# EAGLE schematic LED Driver R1.4 (10cm x 7cm) (EAGLE 6.2)

## Sheet 1 of 2
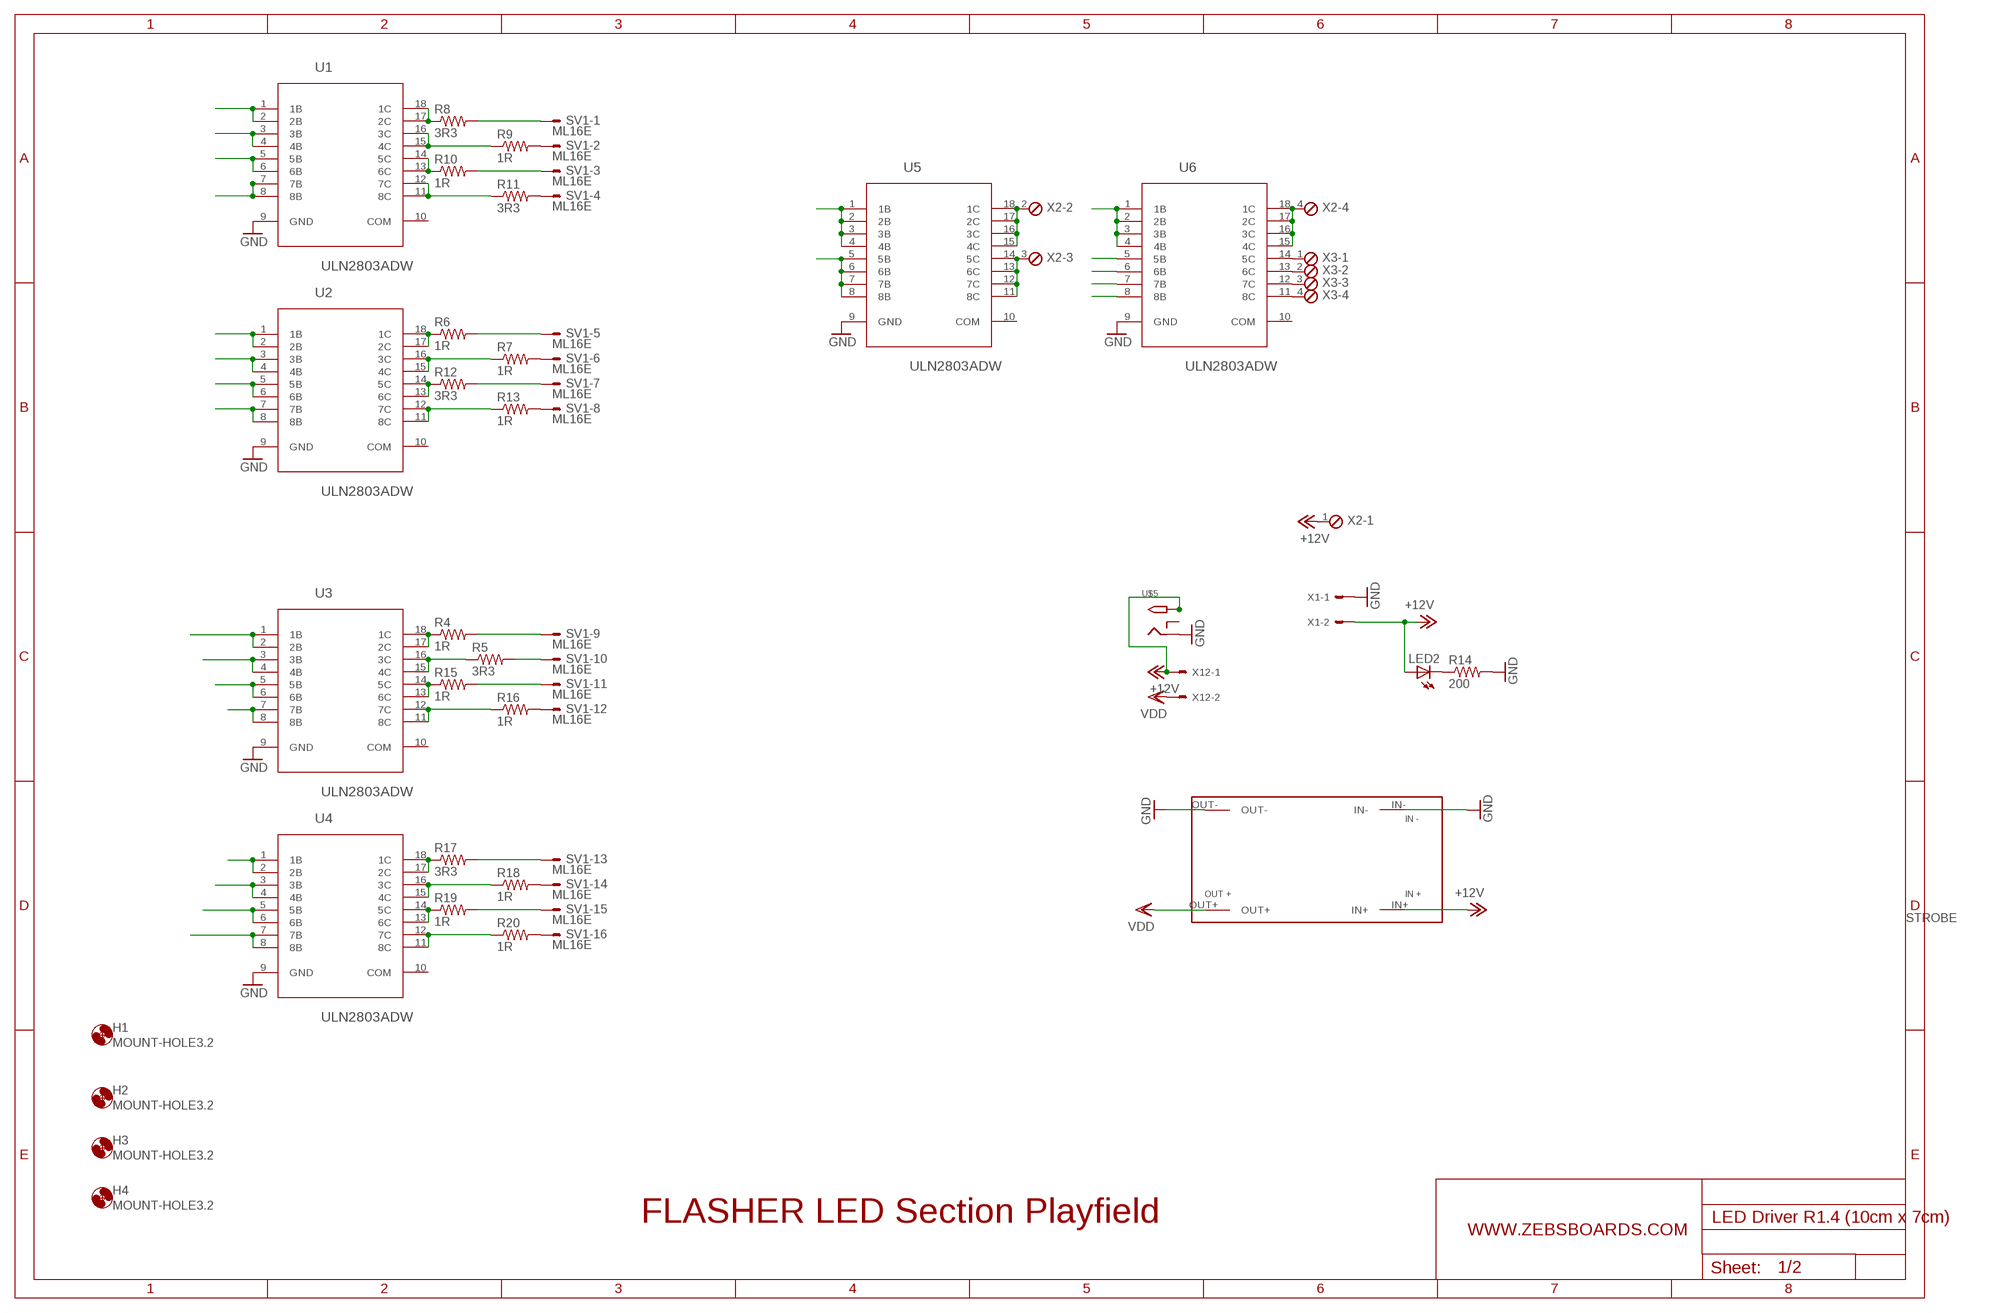
[diagram p0: schematic, sheet 1]

### Parts
H1  MOUNT-HOLE3.2  [3,2]
H2  MOUNT-HOLE3.2  [3,2]
H3  MOUNT-HOLE3.2  [3,2]
H4  MOUNT-HOLE3.2  [3,2]
LED2  LEDCHIP-LED0805  [CHIP-LED0805]
R4  1R  R-US_R2010W  [R2010W]
R5  3R3  R-US_R2010W  [R2010W]
R6  1R  R-US_R2010W  [R2010W]
R7  1R  R-US_R2010W  [R2010W]
R8  3R3  R-US_R2010W  [R2010W]
R9  1R  R-US_R2010W  [R2010W]
R10  1R  R-US_R2010W  [R2010W]
R11  3R3  R-US_R2010W  [R2010W]
R12  3R3  R-US_R2010W  [R2010W]
R13  1R  R-US_R2010W  [R2010W]
R14  200  R-US_M0805  [M0805]
R15  1R  R-US_R2010W  [R2010W]
R16  1R  R-US_R2010W  [R2010W]
R17  3R3  R-US_R2010W  [R2010W]
R18  1R  R-US_R2010W  [R2010W]
R19  1R  R-US_R2010W  [R2010W]
R20  1R  R-US_R2010W  [R2010W]
SV1  ML16E  [ML16]
U1  ULN2803ADW  [SOIC127P1030X265-18N]
U2  ULN2803ADW  [SOIC127P1030X265-18N]
U3  ULN2803ADW  [SOIC127P1030X265-18N]
U4  ULN2803ADW  [SOIC127P1030X265-18N]
U5  ULN2803ADW  [SOIC127P1030X265-18N]
U6  ULN2803ADW  [SOIC127P1030X265-18N]
U$1  DC1ACONVERTER  [DC1CONVERTER]
U$5  2.1MMJACKTHM  [PJ-102A]
X1  KK-156-2  [KK-156-2]
X2  MPT4  [4POL254]
X3  MPT4  [4POL254]
X12  KK-156-2  [KK-156-2]

### Nets
+12V: LED2.A U$1.IN+ U$5.TIP X1.2 X2.1 X12.1
D1: U1.1(1B) U1.2(2B) ; also sheet 2
D2: U1.3(3B) U1.4(4B) ; also sheet 2
D3: U1.5(5B) U1.6(6B) ; also sheet 2
D4: U1.7(7B) U1.8(8B) ; also sheet 2
D5: U2.1(1B) U2.2(2B) ; also sheet 2
D6: U2.3(3B) U2.4(4B) ; also sheet 2
D7: U2.5(5B) U2.6(6B) ; also sheet 2
D8: U2.7(7B) U2.8(8B) ; also sheet 2
D9: U3.1(1B) U3.2(2B) ; also sheet 2
D10: U3.3(3B) U3.4(4B) ; also sheet 2
D11: U3.5(5B) U3.6(6B) ; also sheet 2
D12: U3.7(7B) U3.8(8B) ; also sheet 2
D13: U4.1(1B) U4.2(2B) ; also sheet 2
D14: U4.3(3B) U4.4(4B) ; also sheet 2
D15: U4.5(5B) U4.6(6B) ; also sheet 2
D16: U4.7(7B) U4.8(8B) ; also sheet 2
D17: U5.1(1B) U5.2(2B) U5.3(3B) U5.4(4B) ; also sheet 2
D18: U5.5(5B) U5.6(6B) U5.7(7B) U5.8(8B) ; also sheet 2
D19: U6.1(1B) U6.2(2B) U6.3(3B) U6.4(4B) ; also sheet 2
D20: U6.5(5B) ; also sheet 2
D21: U6.6(6B) ; also sheet 2
D22: U6.7(7B) ; also sheet 2
D23: U6.8(8B) ; also sheet 2
GND: R14.2 U1.9(GND) U2.9(GND) U3.9(GND) U4.9(GND) U5.9(GND) U6.9(GND) U$1.IN- U$1.OUT- U$5.RING X1.1 ; also sheet 2
N$1: R9.1 U1.15(4C) U1.16(3C)
N$2: R8.2 SV1.1
N$3: R10.2 SV1.3
N$4: R11.1 U1.11(8C) U1.12(7C)
N$5: R4.1 U3.17(2C) U3.18(1C)
N$6: R5.2 SV1.10
N$7: R15.1 U3.13(6C) U3.14(5C)
N$8: R8.1 U1.17(2C) U1.18(1C)
N$9: R7.1 U2.15(4C) U2.16(3C)
N$10: R6.2 SV1.5
N$11: R12.2 SV1.7
N$12: R13.1 U2.11(8C) U2.12(7C)
N$13: R9.2 SV1.2
N$14: R10.1 U1.13(6C) U1.14(5C)
N$15: R11.2 SV1.4
N$16: R6.1 U2.17(2C) U2.18(1C)
N$17: R5.1 U3.15(4C) U3.16(3C)
N$18: R4.2 SV1.9
N$19: R15.2 SV1.11
N$20: R16.1 U3.11(8C) U3.12(7C)
N$21: R7.2 SV1.6
N$22: R12.1 U2.13(6C) U2.14(5C)
N$23: R13.2 SV1.8
N$24: R16.2 SV1.12
N$25: R18.1 U4.15(4C) U4.16(3C)
N$26: LED2.C R14.1
N$27: R17.2 SV1.13
N$28: R19.2 SV1.15
N$29: R20.1 U4.11(8C) U4.12(7C)
N$30: R17.1 U4.17(2C) U4.18(1C)
N$31: R18.2 SV1.14
N$32: R19.1 U4.13(6C) U4.14(5C)
N$33: R20.2 SV1.16
N$42: U5.15(4C) U5.16(3C) U5.17(2C) U5.18(1C) X2.2
N$43: U5.11(8C) U5.12(7C) U5.13(6C) U5.14(5C) X2.3
N$44: U6.15(4C) U6.16(3C) U6.17(2C) U6.18(1C) X2.4
N$45: U6.14(5C) X3.1
N$46: U6.13(6C) X3.2
N$47: U6.12(7C) X3.3
N$48: U6.11(8C) X3.4
VDD: U$1.OUT+ X12.2
Unconnected: U1.10(COM) U2.10(COM) U3.10(COM) U4.10(COM) U5.10(COM) U6.10(COM) U$5.RING_SW

### Notes on the sheet
- STROBE
- FLASHER LED Section Playfield
- WWW.ZEBSBOARDS.COM

## Sheet 2 of 2
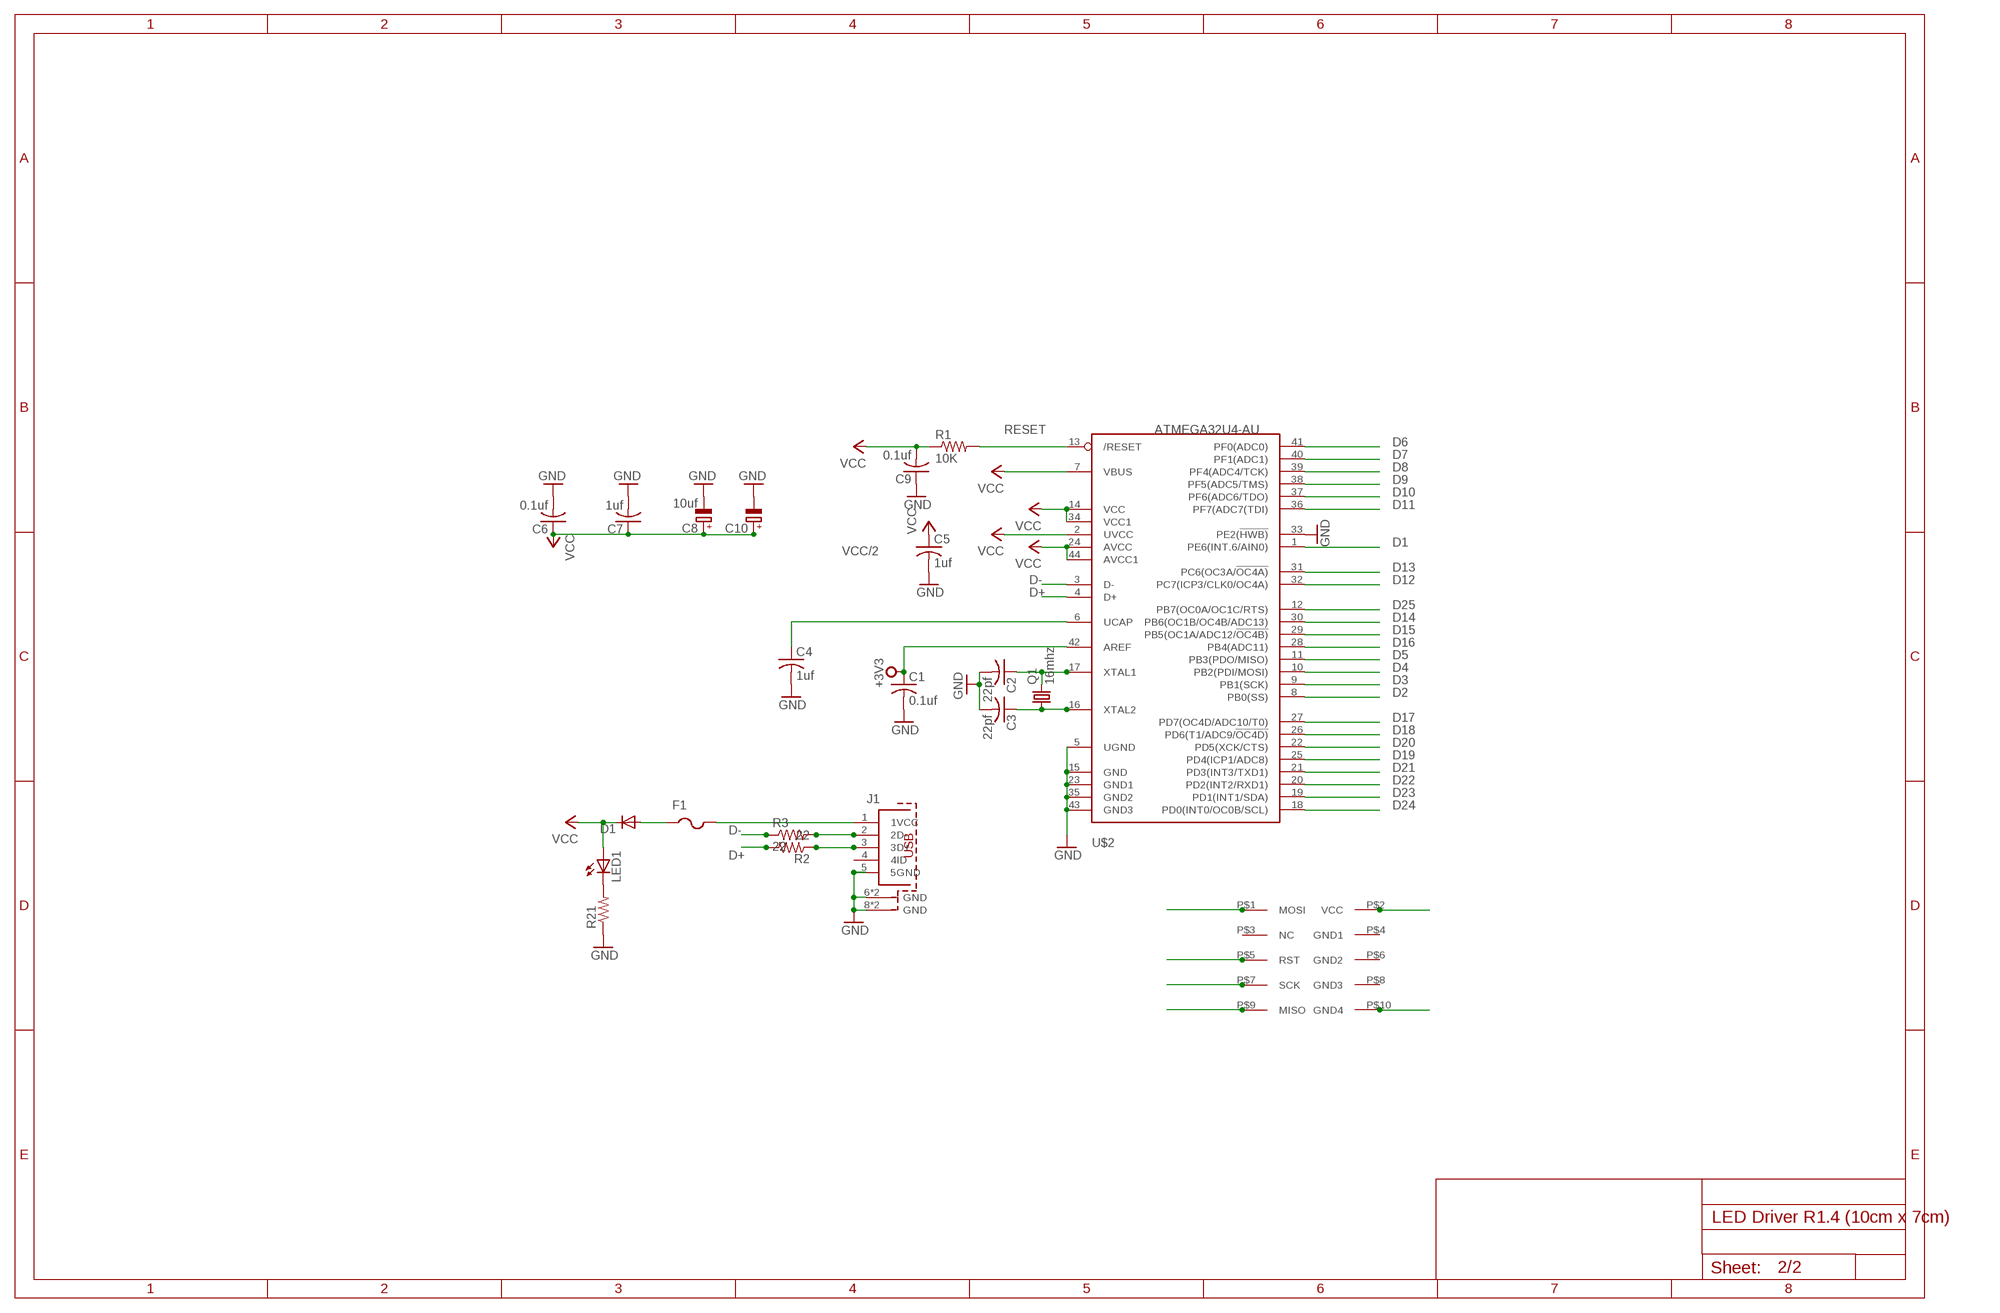
[diagram p1: schematic, sheet 2]

### Parts
C1  0.1uf  C-USC0603  [C0603]
C2  22pf  C-USC0603  [C0603]
C3  22pf  C-USC0603  [C0603]
C4  1uf  C-USC0603  [C0603]
C5  1uf  C-USC0603  [C0603]
C6  0.1uf  C-USC0603  [C0603]
C7  1uf  C-USC0603  [C0603]
C8  10uf  CPOL-EUA/3216-18W  [A/3216-18W]
C9  0.1uf  C-USC0603  [C0603]
C10  CPOL-EU153CLV-0605  [153CLV-0605]
D1  DIODE-DO214AC  [DO214AC]
F1  PTCFUSE-1812  [1812]
J1  651005136521  [651005136521]
LED1  LEDCHIPLED_0805  [CHIPLED_0805]
Q1  16mhz  CRYSTALCTS406  [CTS406]
R1  10K  R-US_M0805  [M0805]
R2  22  R-US_M0805  [M0805]
R3  22  R-US_M0805  [M0805]
R21  R-US_M0805  [M0805]
U$2  ATMEGA32U4-AU  [TQFP44]
U$4  10PICSP  [10PICSP]

### Nets
+3V3: C1.1 U$2.42(AREF)
D1: U$2.1(PE6(INT.6/AIN0)) ; also sheet 1
D2: U$2.8(PB0(SS)) ; also sheet 1
D3: U$2.9(PB1(SCK)) U$4.P$7(SCK) ; also sheet 1
D4: U$2.10(PB2(PDI/MOSI)) U$4.P$1(MOSI) ; also sheet 1
D5: U$2.11(PB3(PDO/MISO)) U$4.P$9(MISO) ; also sheet 1
D6: U$2.41(PF0(ADC0)) ; also sheet 1
D7: U$2.40(PF1(ADC1)) ; also sheet 1
D8: U$2.39(PF4(ADC4/TCK)) ; also sheet 1
D9: U$2.38(PF5(ADC5/TMS)) ; also sheet 1
D10: U$2.37(PF6(ADC6/TDO)) ; also sheet 1
D11: U$2.36(PF7(ADC7(TDI)) ; also sheet 1
D12: U$2.32(PC7(ICP3/CLK0/OC4A)) ; also sheet 1
D13: U$2.31(PC6(OC3A/!OC4A)) ; also sheet 1
D14: U$2.30(PB6(OC1B/OC4B/ADC13)) ; also sheet 1
D15: U$2.29(PB5(OC1A/ADC12/!OC4B)) ; also sheet 1
D16: U$2.28(PB4(ADC11)) ; also sheet 1
D17: U$2.27(PD7(OC4D/ADC10/T0)) ; also sheet 1
D18: U$2.26(PD6(T1/ADC9/!OC4D)) ; also sheet 1
D19: U$2.25(PD4(ICP1/ADC8)) ; also sheet 1
D20: U$2.22(PD5(XCK/CTS)) ; also sheet 1
D21: U$2.21(PD3(INT3/TXD1)) ; also sheet 1
D22: U$2.20(PD2(INT2/RXD1)) ; also sheet 1
D23: U$2.19(PD1(INT1/SDA)) ; also sheet 1
D24: U$2.18(PD0(INT0/OC0B/SCL))
D25: U$2.12(PB7(OC0A/OC1C/RTS))
D+: R2.2 U$2.4(D+)
D-: R3.1 U$2.3(D-)
GND: C1.2 C2.2 C3.2 C4.2 C5.2 C6.2 C7.2 C8.- C9.1 C10.- J1.5(5GND) J1.6(GND) J1.7(GND) J1.8(GND) J1.9(GND) R21.1 U$2.5(UGND) U$2.15(GND) U$2.23(GND1) U$2.33(PE2(!HWB)) U$2.35(GND2) U$2.43(GND3) U$4.P$10(GND4) ; also sheet 1
N$34: C2.1 Q1.3 U$2.17(XTAL1)
N$35: C3.1 Q1.1 U$2.16(XTAL2)
N$36: C4.1 U$2.6(UCAP)
N$37: J1.2(2D-) R3.2
N$38: J1.3(3D+) R2.1
N$39: F1.2 J1.1(1VCC)
N$40: D1.A F1.1
N$41: LED1.C R21.2
RST: R1.2 U$2.13(/RESET) U$4.P$5(RST)
VCC: C5.1 C6.1 C7.1 C8.+ C9.2 C10.+ D1.C LED1.A R1.1 U$2.2(UVCC) U$2.7(VBUS) U$2.14(VCC) U$2.24(AVCC) U$2.34(VCC1) U$2.44(AVCC1) U$4.P$2(VCC)
Unconnected: J1.4(4ID) U$4.P$3(NC) U$4.P$4(GND1) U$4.P$6(GND2) U$4.P$8(GND3)

### Notes on the sheet
- RESET
- D6
- D7
- D8
- D9
- D10
- D11
- VCC/2 | D1
- D13
- D- | D12
- D+
- D25
- D14
- D15
- D16
- D5
- D4
- D3
- D2
- D17
- D18
- D20
- D19
- D21
- D22
- D23
- D24
- D-
- D+

## Library data of the parts
C1-C3 C6 C9 = adafruit:C-US: CAPACITOR, American symbol
C4 C5 C7 = resistor:C-US: CAPACITOR, American symbol
C8 C10 = resistor:CPOL-EU: POLARIZED CAPACITOR, European symbol
D1 = diode:DIODE-: DIODE
F1 = adafruit:PTCFUSE: PTC fuses, resettable thermistors
H1-H4 = holes:MOUNT-HOLE: MOUNTING HOLE with drill center marker
J1 = Wurth_Elektronik_Electromechanic_Input-Output_Connectors_rev16b:651005136521: WR-COM Horizontal 5 Contacts Mini USB Typ B=>Code : Con_I-O_COM_MiniUSB_651005136521 <http://katalog.we-online.de/media/images/eican/Con_I-O_COM_MiniUSB_651005136521_pf2.jpg> Details see: http://katalog.we-online.de/en/em/651_005_136_521 Created 2014-07-09, Karrer Zheng 2014 (C) Würth Elektronik
LED1 LED2 = led:LED: LED OSRAM: - CHIPLED LG R971, LG N971, LY N971, LG Q971, LY Q971, LO R971, LY R971 LH N974, LH R974 LS Q976, LO Q976, LY Q976 LO Q996 - Hyper CHIPLED LW Q18S LB Q993, LB Q99A, LB R99A - SideLED LS A670, LO A670, LY A670, LG A670, LP A670 LB A673, LV A673, LT A673, LW A673 LH A674 LY A675 LS A676, LA A676, LO A676, LY A676, LW A676 LS A679, LY A679, LG A679 - Hyper Micro SIDELED® LS Y876, LA Y876, LO Y876, LY Y876 LT Y87S - SmartLED LW L88C, LW L88S LB L89C, LB L89S, LG L890 LS L89K, LO L89K, LY L89K LS L896, LA L896, LO L896, LY L896 - TOPLED LS T670, LO T670, LY T670, LG T670, LP T670 LSG T670, LSP T670, LSY T670, LOP T670, LYG T670 LG T671, LOG T671, LSG T671 LB T673, LV T673, LT T673, LW T673 LH T674 LS T676, LA T676, LO T676, LY T676, LB T676, LH T676, LSB T676, LW T676 LB T67C, LV T67C, LT T67C, LS T67K, LO T67K, LY T67K, LW E67C LS E67B, LA E67B, LO E67B, LY E67B, LB E67C, LV E67C, LT E67C LW T67C LS T679, LY T679, LG T679 LS T770, LO T770, LY T770, LG T770, LP T770 LB T773, LV T773, LT T773, LW T773 LH T774 LS E675, LA E675, LY E675, LS T675 LS T776, LA T776, LO T776, LY T776, LB T776 LHGB T686 LT T68C, LB T68C - Hyper Mini TOPLED® LB M676 - Mini TOPLED Santana® LG M470 LS M47K, LO M47K, LY M47K Source: http://www.osram.convergy.de LUXEON: - LUMILED® LXK2-PW12-R00, LXK2-PW12-S00, LXK2-PW14-U00, LXK2-PW14-V00 LXK2-PM12-R00, LXK2-PM12-S00, LXK2-PM14-U00 LXK2-PE12-Q00, LXK2-PE12-R00, LXK2-PE12-S00, LXK2-PE14-T00, LXK2-PE14-U00 LXK2-PB12-K00, LXK2-PB12-L00, LXK2-PB12-M00, LXK2-PB14-N00, LXK2-PB14-P00, LXK2-PB14-Q00 LXK2-PR12-L00, LXK2-PR12-M00, LXK2-PR14-Q00, LXK2-PR14-R00 LXK2-PD12-Q00, LXK2-PD12-R00, LXK2-PD12-S00 LXK2-PH12-R00, LXK2-PH12-S00 LXK2-PL12-P00, LXK2-PL12-Q00, LXK2-PL12-R00 Source: www.luxeon.com KINGBRIGHT: KA-3528ASYC Source: www.kingbright.com
Q1 = crystal:CRYSTAL: CRYSTAL; OC_FARNELL: unknown; OC_NEWARK: unknown
R1-R21 = resistor:R-US_: RESISTOR, American symbol
SV1 = con-harting-ml:ML16?E: HARTING; OC_FARNELL: unknown; OC_NEWARK: unknown
U1-U6 = ULNsmd:ULN2803ADW: Darlington transistor array; MPN: ULN2803ADW; OC_FARNELL: 1652419; OC_NEWARK: 69K0711; PACKAGE: SOIC-18; SUPPLIER: TEXAS INSTRUMENTS
U$1 = DC 1A Converter:DC1ACONVERTER
U$2 = adafruit:ATMEGA32U4: http://www.ladyada.net/library/eagle
U$4 = 10p ISCP:10PICSP
U$5 = adafruit:2.1MMJACK: 2.1mm x 5.5mm THM DC jack with internal switch. Digikey part #PJ-102A, 4UCON part #05537 2.1mm x 5.5mm SMT DC jack with internal switch. Digikey part #PJ-002A-SMT, 4UCON part #03267 By microbuilder.eu & adafruit.com
X1 X12 = con-molex:KK-156-2: KK 156 HEADER Source: http://www.molex.com/pdm_docs/sd/026604100_sd.pdf; OC_FARNELL: unknown; OC_NEWARK: unknown
X2 X3 = con-phoenix-254:MPT4: PHOENIX CONNECTOR; OC_FARNELL: unknown; OC_NEWARK: unknown